# EAGLE design d1-mini-onboard (EAGLE 9.6.2)
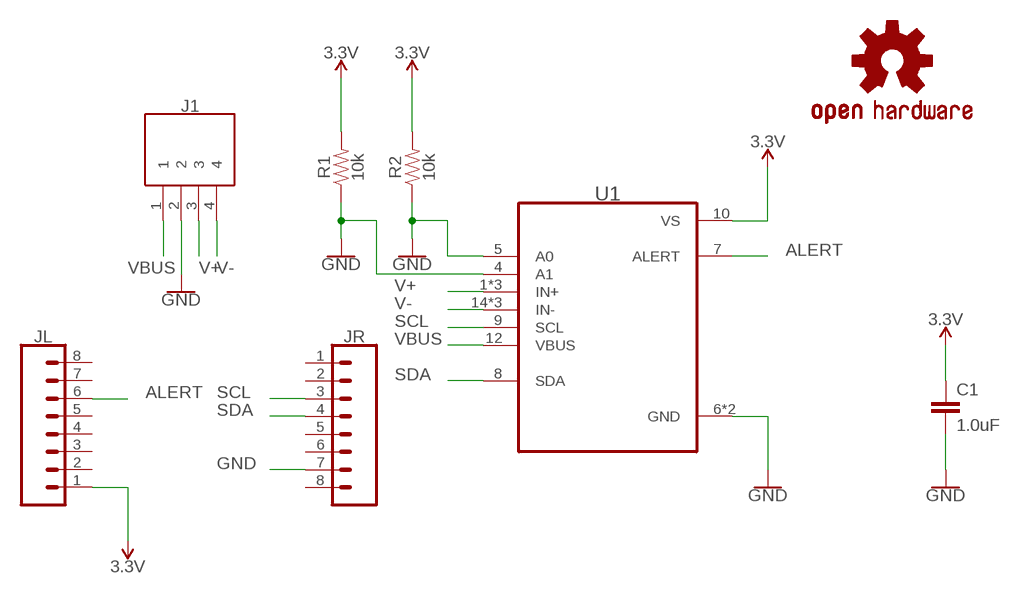
[diagram p0: schematic, sheet 1]

## Parts
C1  1.0uF  1.0UF-1206-50V-10%  [1206]
J1  282834-4  [2828344]
JL  CONN_08NO_SILK_FEMALE_PTH  [1X08_NO_SILK]
JR  CONN_08NO_SILK_FEMALE_PTH  [1X08_NO_SILK]
LOGO1  OSHW-LOGOS  [OSHW-LOGO-S]
R1  10k  RESISTOR1206  [1206]
R2  10k  RESISTOR1206  [1206]
U1  INA260AIPWR  [SOP65P640X120-16N]

## Nets
3.3V [signal]: C1.1 JL.1 R1.2 R2.2 U1.10(VS)
ALERT [signal]: JL.6 U1.7(ALERT)
GND [signal]: C1.2 J1.2 JR.7 R1.1 R2.1 U1.4(A1) U1.5(A0) U1.6(GND) U1.11(GND)
SCL [signal]: JR.3 U1.9(SCL)
SDA [signal]: JR.4 U1.8(SDA)
V+ [current]: J1.3 U1.1(IN+) U1.2(IN+) U1.3(IN+)
V- [current]: J1.4 U1.14(IN-) U1.15(IN-) U1.16(IN-)
VBUS [signal]: J1.1 U1.12(VBUS)
Unconnected: JL.2 JL.3 JL.4 JL.5 JL.7 JL.8 JR.1 JR.2 JR.5 JR.6 JR.8

## Library data of the parts
C1 = SparkFun-Capacitors:1.0UF: 1µF ceramic capacitors A capacitor is a passive two-terminal electrical component used to store electrical energy temporarily in an electric field.; PROD_ID: CAP-09822
J1 = 282834-4:282834-4: ic Source: Datasheet <https://www.te.com/commerce/DocumentDelivery/DDEController?Action=srchrtrv&DocNm=282834&DocType=Customer Drawing&DocLang=English&PartCntxt=282834-4&DocFormat=pdf>; DESCRIPTION: ic; HEIGHT: 10.3mm; MANUFACTURER_NAME: TE Connectivity; MANUFACTURER_PART_NUMBER: 282834-4; MOUSER_PART_NUMBER: 571-282834-4; MOUSER_PRICE-STOCK: https://www.mouser.co.uk/ProductDetail/TE-Connectivity/282834-4?qs=A%252Bip%252BNCYi6Pqom9P%2FaHyRQ%3D%3D
JL JR = SparkFun-Connectors:CONN_08: Multi connection point. Often used as Generic Header-pin footprint for 0.1 inch spaced/style header connections On any of the 0.1 inch spaced packages, you can populate with these: Break Away Headers - Straight <https://www.sparkfun.com/products/116> (PRT-00116) Break Away Male Headers - Right Angle <https://www.sparkfun.com/products/553> (PRT-00553) Female Headers <https://www.sparkfun.com/products/115> (PRT-00115) Break Away Headers - Machine Pin <https://www.sparkfun.com/products/117> (PRT-00117) Break Away Female Headers - Swiss Machine Pin <https://www.sparkfun.com/products/743> (PRT-00743) Arduino Stackable Header - 8 Pin <https://www.sparkfun.com/products/9279> (PRT-09279) For SCREWTERMINALS and SPRING TERMINALS visit here: Screw Terimnals on SparkFun.com <https://www.sparkfun.com/search/results?term=Screw+Terminals> (5mm/3.5mm/2.54mm spacing) This device is also useful as a general connection point to wire up your design to another part of your project. Our various solder wires solder well into these plated through hole pads. Hook-Up Wire - Assortment (Stranded, 22 AWG) <https://www.sparkfun.com/products/11375> (PRT-11375) Hook-Up Wire - Assortment (Solid Core, 22 AWG) <https://www.sparkfun.com/products/11367> (PRT-11367) View the entire wire category on our website here <https://www.sparkfun.com/categories/141> Special notes: Molex polarized connector foot print use with SKU : PRT-08231 with associated crimp pins and housings. 1MM SMD Version SKU: PRT-10208 NOTES ON THE VARIANTS LOCK and LOCK_LONGPADS... This footprint was designed to help hold the alignment of a through-hole component (i.e. 6-pin header) while soldering it into place. You may notice that each hole has been shifted either up or down by 0.005 of an inch from it's more standard position (which is a perfectly straight line). This slight alteration caused the pins (the squares in the middle) to touch the edges of the holes. Because they are alternating, it causes a "brace" to hold the component in place. 0.005 has proven to be the perfect amount of "off-center" position when using our standard breakaway headers. Although looks a little odd when you look at the bare footprint, once you have a header in there, the alteration is very hard to notice. Also,if you push a header all the way into place, it is covered up entirely on the bottom side.; PROD_ID: CONN-08438
LOGO1 = SparkFun-Aesthetics:OSHW-LOGO: Open-Source Hardware (OSHW) Logo This logo indicates the piece of hardware it is found on incorporates a OSHW license and/or adheres to the definition of open source hardware found here: http://freedomdefined.org/OSHW
R1 R2 = SparkFun-Resistors:RESISTOR: Generic Resistor Package
U1 = INA260AIPWR:INA260AIPWR: Check prices <https://pricing.snapeda.com/parts/INA260AIPWR/Texas%20Instruments/view-part?ref=eda>; AVAILABILITY: In Stock; DESCRIPTION: 36V, 16-bit, precision i2c output current/voltage/power monitor w/ int. shunt resistor 16-TSSOP -40 to 125; MF: Texas Instruments; MP: INA260AIPWR; PACKAGE: TSSOP-16 Texas Instruments; PRICE: None; PURCHASE-URL: https://pricing.snapeda.com/search/part/INA260AIPWR/?ref=eda

## Net classes
1 signal: width 0.102 mm, clearance 0.051 mm
2 current: width 1.524 mm, clearance 0.152 mm

## Board
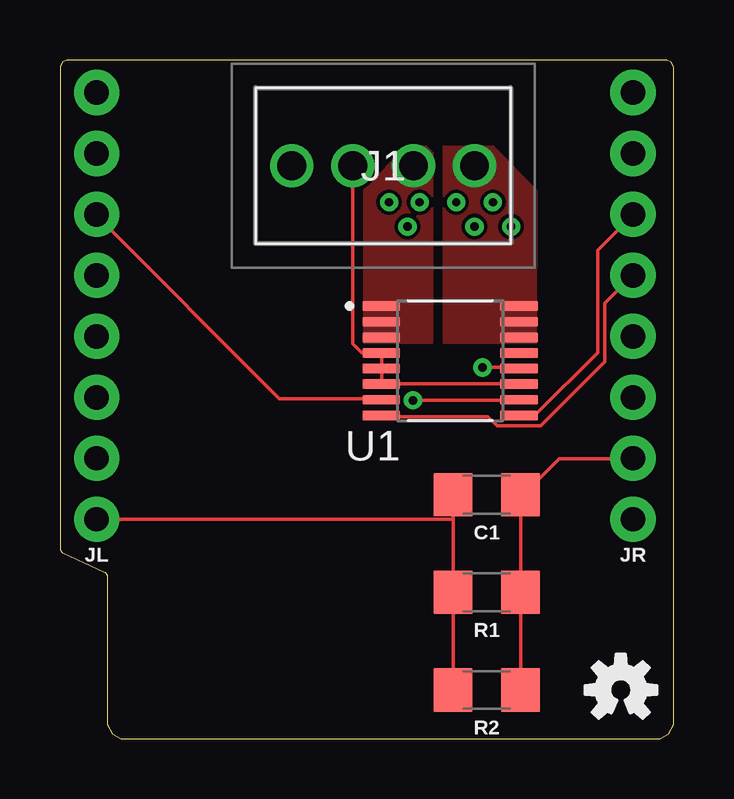
[diagram p1: board, top side]
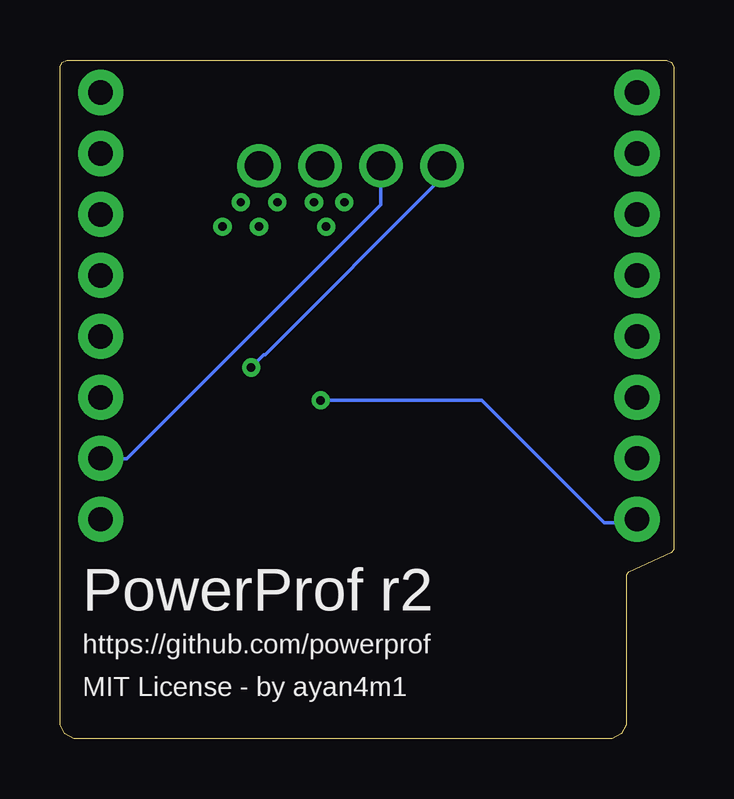
[diagram p2: board, bottom side, seen from below]

Size 25.57 x 28.28 mm. Coordinates in mm from the lower left corner, seen from the top.
Outline: 25.28,28.28 0.29,28.28 0.1,28.18 0,27.99 0,7.88 0.09,7.76 0.11,7.75 1.87,6.94 1.88,6.93 1.97,6.8 1.97,0.58 2.18,0.21 2.55,0 24.99,0 25.36,0.21 25.57,0.58 25.57,27.99 25.47,28.18 25.28,28.28
Copper layers (1*16): Top 0.035mm / dielectric 0.15mm / Bottom 0.035mm
Design rules "default *": minimum track width 6mil, minimum drill 0.35mm, track to track 6mil, track to pad 6mil, pad to pad 6mil, via to via 6mil, smd to smd 6mil, copper to edge 10mil, drill to drill 6mil, minimum pad ring 10mil, minimum via ring 8mil, stop-mask expansion 4mil, vias tented up to drill 0mil, thermal gap 10mil

### Footprints (pad centres in the part's own frame; a part is rotated, then mirrored left to right if it is on the bottom)
1206 = smd 1.6 x 1.8: 1 -1.4,0; 2 1.4,0
2828344 = drill 1.2 pad 1.8: 1 0,0; 2 2.54,0; 3 5.08,0; 4 7.62,0
1X08_NO_SILK = drill 1.016 pad 1.88: 1 0,0; 2 2.54,0; 3 5.08,0; 4 7.62,0; 5 10.16,0; 6 12.7,0; 7 15.24,0; 8 17.78,0
SOP65P640X120-16N = smd 1.57 x 0.41: 1 -2.87,2.275; 2 -2.87,1.625; 3 -2.87,0.975; 4 -2.87,0.325; 5 -2.87,-0.325; 6 -2.87,-0.975; 7 -2.87,-1.625; 8 -2.87,-2.275; 9 2.87,-2.275; 10 2.87,-1.625; 11 2.87,-0.975; 12 2.87,-0.325; 13 2.87,0.325; 14 2.87,0.975; 15 2.87,1.625; 16 2.87,2.275

### Placement (x,y rotation side)
C1  17.78,10.16 0 top
J1  9.65,23.88 0 top
JL  1.52,9.14 90 top
JR  23.88,26.92 270 top
LOGO1  23.37,2.03 0 top
R1  17.78,6.1 180 top
R2  17.78,2.03 180 top
U1  16.26,15.75 0 top

### Tracks (layer width: path | path; a pad name or v marks a point on that pad's centre or on a via)
3.3V  (via drill 0.35)
  Top 0.152: R1.2 16.38,2.06 R2.2 | R1.2 16.38,9.14 | 16.38,9.14 16.38,10.13 C1.1 | R1.2 | v14.71,14.1 19.05,14.1 U1.10 | JL.1 16.38,9.14
  Bottom 0.152: v14.71,14.1 8,14.1 2.9,8.99 1.68,8.99 JL.1
ALERT
  Top 0.152: U1.7 13.34,14.17 9.14,14.17 1.52,21.79 JL.6
GND
  Top 0.152: U1.11 19.05,14.78 13.49,14.78 U1.6 13.41,14.78 13.41,15.39 U1.5 13.41,15.47 13.41,16 U1.4 13.34,16.08 12.57,16.08 12.19,16.46 J1.2 | 19.2,6.1 19.2,2.06 R2.1 | 19.2,6.1 19.2,10.13 C1.2 19.28,10.13 20.8,11.66 23.85,11.66 JR.7 | 19.2,6.1 R1.1
  Bottom 0.152: J1.2 12.19,22.25 22.78,11.66 23.85,11.66 JR.7
N$1  (via drill 0.35)
  other vias: 16.51,22.35
N$2  (via drill 0.35)
  other vias: 17.27,21.34
N$3  (via drill 0.35)
  other vias: 18.03,22.35
N$4  (via drill 0.35)
  other vias: 18.8,21.34
N$5  (via drill 0.35)
  other vias: 14.99,22.35
N$6  (via drill 0.35)
  other vias: 14.48,21.34
N$7  (via drill 0.35)
  other vias: 13.72,22.35
SCL
  Top 0.152: U1.9 19.13,13.49 19.81,13.49 22.4,16.08 22.4,20.34 23.85,21.79 JR.3
SDA
  Top 0.152: JR.4 22.71,18.14 22.71,15.7 20.04,13.03 18.21,13.03 17.83,13.41 13.41,13.41 U1.8
V+
  pour Top (no thermals): 12.7,16.51 12.7,22.86 14.48,24.64 15.24,24.64 15.49,24.38 15.49,16.51
V-
  pour Top (no thermals): 19.81,16.51 19.81,22.86 18.03,24.64 16,24.64 16,16.51
VBUS  (via drill 0.35)
  Top 0.152: v17.6,15.47 19.05,15.47 U1.12
  Bottom 0.152: J1.1 9.65,23.37 17.02,16 17.07,16 v17.6,15.47

### Text on the board
bPlace: PowerProf r2 | https://github.com/powerprof | MIT License - by ayan4m1